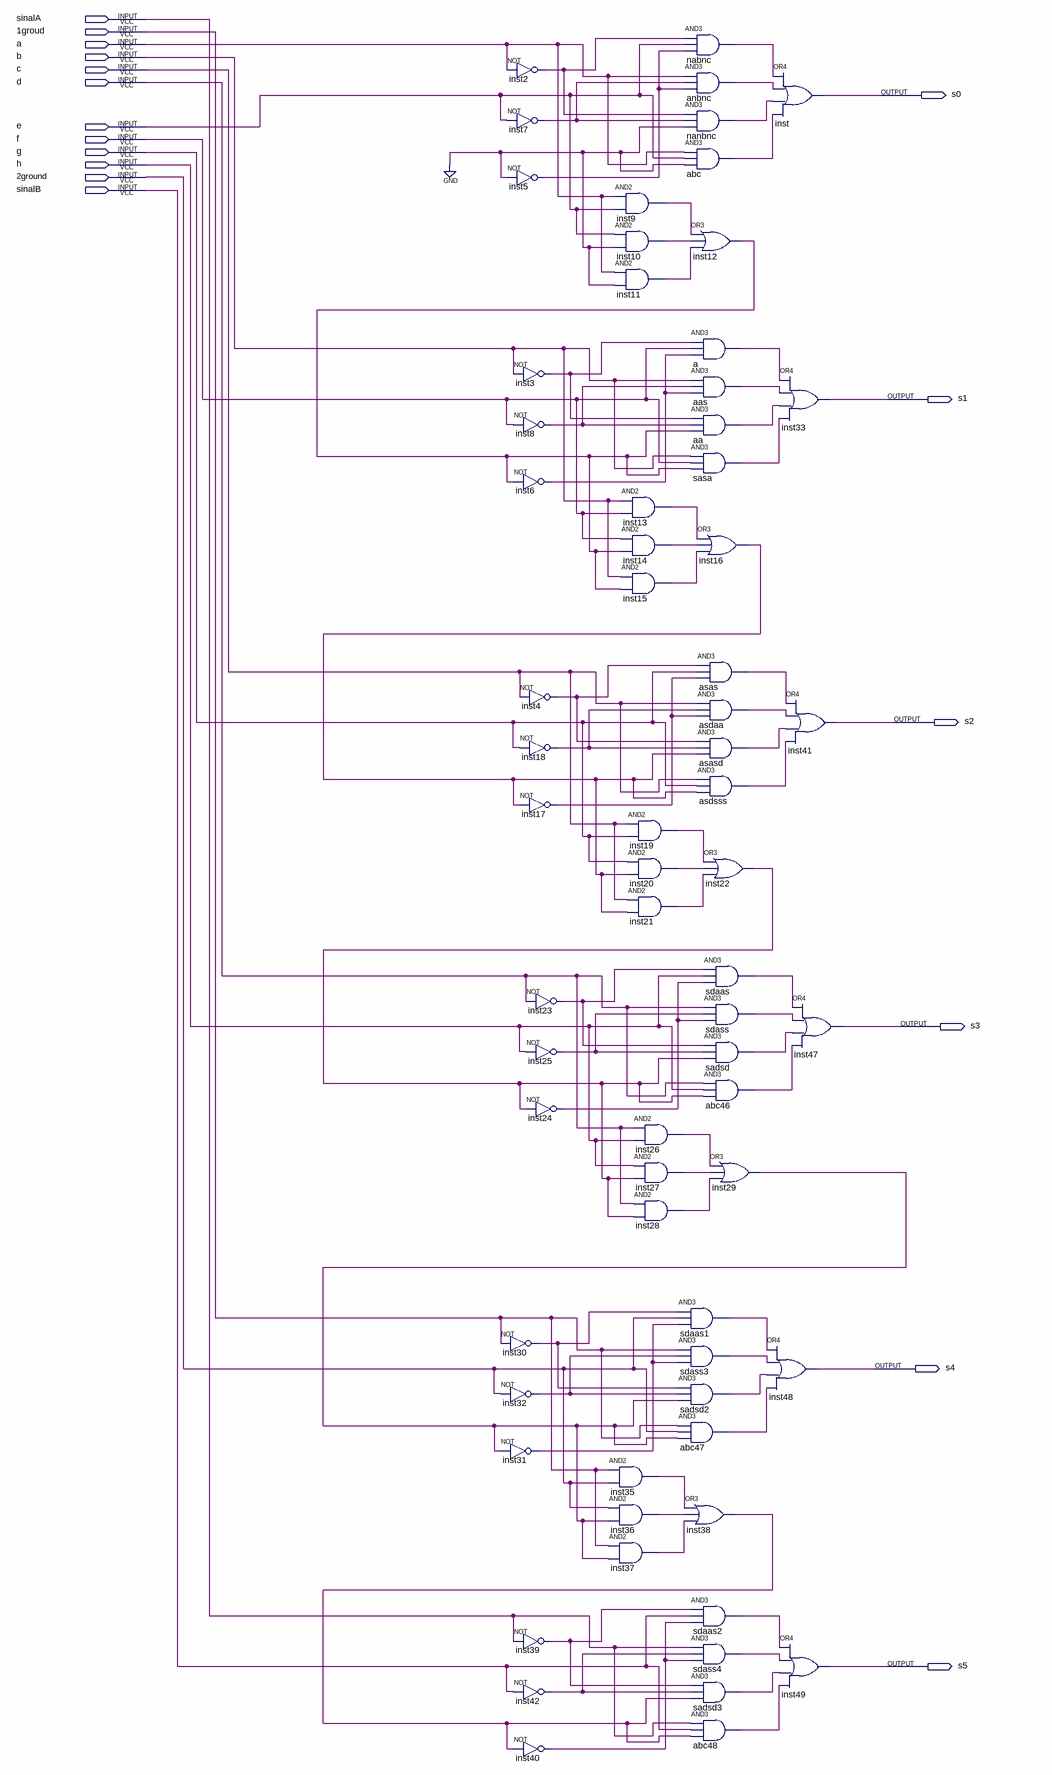
[diagram p0: schematic sheet]
// Quartus schematic ULAULA-SOMA-esquema.bdf as structural Verilog: 68 symbols, 18 pins
module \ULAULA-SOMA-esquema  (
  input  sinalA,
  input  \1groud ,
  input  a,
  input  b,
  input  c,
  input  d,
  input  e,
  input  f,
  input  g,
  input  h,
  input  \2ground ,
  input  sinalB,
  output s0,
  output s1,
  output s2,
  output s3,
  output s4,
  output s5
);

  wire a_out, aa_out, aas_out, abc46_out, abc47_out, abc48_out, abc_out, anbnc_out, asas_out, asasd_out,
       asdaa_out, asdsss_out, inst2_out, inst3_out, inst4_out, inst5_out, inst6_out, inst7_out, inst8_out,
       inst9_out, inst10_out, inst11_out, inst12_out, inst13_out, inst14_out, inst15_out, inst16_out,
       inst17_out, inst18_out, inst19_out, inst20_out, inst21_out, inst22_out, inst23_out, inst24_out,
       inst25_out, inst26_out, inst27_out, inst28_out, inst29_out, inst30_out, inst31_out, inst32_out,
       inst35_out, inst36_out, inst37_out, inst38_out, inst39_out, inst40_out, inst42_out, nabnc_out,
       nanbnc_out, sadsd2_out, sadsd3_out, sadsd_out, sasa_out, sdaas1_out, sdaas2_out, sdaas_out,
       sdass3_out, sdass4_out, sdass_out;

  not inst2 (inst2_out, a);
  not inst7 (inst7_out, e);
  not inst5 (inst5_out, 1'b0);
  not inst3 (inst3_out, b);
  not inst8 (inst8_out, f);
  not inst6 (inst6_out, inst12_out);
  not inst4 (inst4_out, c);
  not inst18 (inst18_out, g);
  not inst17 (inst17_out, inst16_out);
  not inst23 (inst23_out, d);
  not inst25 (inst25_out, h);
  not inst24 (inst24_out, inst22_out);
  not inst30 (inst30_out, \1groud );
  not inst32 (inst32_out, \2ground );
  not inst31 (inst31_out, inst29_out);
  not inst39 (inst39_out, sinalA);
  not inst42 (inst42_out, sinalB);
  not inst40 (inst40_out, inst38_out);
  and inst9 (inst9_out, a, e);
  and inst10 (inst10_out, e, 1'b0);
  and inst11 (inst11_out, a, 1'b0);
  and inst13 (inst13_out, b, f);
  and inst14 (inst14_out, f, inst12_out);
  and inst15 (inst15_out, b, inst12_out);
  and inst19 (inst19_out, c, g);
  and inst20 (inst20_out, g, inst16_out);
  and inst21 (inst21_out, c, inst16_out);
  and inst35 (inst35_out, \1groud , \2ground );
  and inst36 (inst36_out, \2ground , inst29_out);
  and inst37 (inst37_out, \1groud , inst29_out);
  and inst26 (inst26_out, d, h);
  and inst27 (inst27_out, h, inst22_out);
  and inst28 (inst28_out, d, inst22_out);
  and sdaas1 (sdaas1_out, inst30_out, \2ground , inst31_out);
  and sdass3 (sdass3_out, \1groud , inst32_out, inst31_out);
  and sadsd2 (sadsd2_out, inst30_out, inst32_out, inst29_out);
  and abc47 (abc47_out, \1groud , \2ground , inst29_out);
  and nabnc (nabnc_out, inst2_out, e, inst5_out);
  and anbnc (anbnc_out, a, inst7_out, inst5_out);
  and nanbnc (nanbnc_out, inst2_out, inst7_out, 1'b0);
  and abc (abc_out, a, e, 1'b0);
  or inst12 (inst12_out, inst9_out, inst10_out, inst11_out);
  and u_a (a_out, inst3_out, f, inst6_out);
  and aas (aas_out, b, inst8_out, inst6_out);
  and aa (aa_out, inst3_out, inst8_out, inst12_out);
  and sasa (sasa_out, b, f, inst12_out);
  or inst16 (inst16_out, inst13_out, inst14_out, inst15_out);
  and asas (asas_out, inst4_out, g, inst17_out);
  and asdaa (asdaa_out, c, inst18_out, inst17_out);
  and asasd (asasd_out, inst4_out, inst18_out, inst16_out);
  and asdsss (asdsss_out, c, g, inst16_out);
  or inst22 (inst22_out, inst19_out, inst20_out, inst21_out);
  and sdaas (sdaas_out, inst23_out, h, inst24_out);
  and sdass (sdass_out, d, inst25_out, inst24_out);
  and sadsd (sadsd_out, inst23_out, inst25_out, inst22_out);
  and abc46 (abc46_out, d, h, inst22_out);
  or inst29 (inst29_out, inst26_out, inst27_out, inst28_out);
  or inst38 (inst38_out, inst35_out, inst36_out, inst37_out);
  and sdaas2 (sdaas2_out, inst39_out, sinalB, inst40_out);
  and sdass4 (sdass4_out, sinalA, inst42_out, inst40_out);
  and sadsd3 (sadsd3_out, inst39_out, inst42_out, inst38_out);
  and abc48 (abc48_out, sinalA, sinalB, inst38_out);
  or inst (s0, nabnc_out, anbnc_out, nanbnc_out, abc_out);
  or inst33 (s1, a_out, aas_out, aa_out, sasa_out);
  or inst48 (s4, sdaas1_out, sdass3_out, sadsd2_out, abc47_out);
  or inst49 (s5, sdaas2_out, sdass4_out, sadsd3_out, abc48_out);
  or inst41 (s2, asas_out, asdaa_out, asasd_out, asdsss_out);
  or inst47 (s3, sdaas_out, sdass_out, sadsd_out, abc46_out);
endmodule
